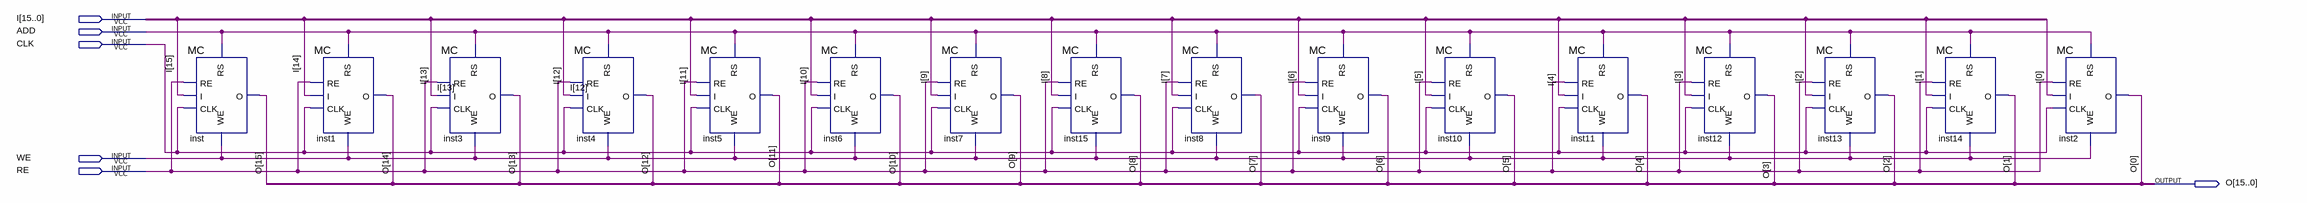
[diagram p0: schematic sheet]
// Quartus schematic DMEM1x16.bdf as structural Verilog: 16 symbols, 6 pins
module DMEM1x16 (
  input  [15:0] I,
  input  ADD,
  input  CLK,
  input  WE,
  input  RE,
  output [15:0] O
);

  MC inst (.RS(ADD), .RE(RE), .CLK(CLK), .I(I[15]), .WE(WE), .O(O[15]));
  MC inst1 (.RS(ADD), .RE(RE), .CLK(CLK), .I(I[14]), .WE(WE), .O(O[14]));
  MC inst3 (.RS(ADD), .RE(RE), .CLK(CLK), .I(I[13]), .WE(WE), .O(O[13]));
  MC inst4 (.RS(ADD), .RE(RE), .CLK(CLK), .I(I[12]), .WE(WE), .O(O[12]));
  MC inst5 (.RS(ADD), .RE(RE), .CLK(CLK), .I(I[11]), .WE(WE), .O(O[11]));
  MC inst6 (.RS(ADD), .RE(RE), .CLK(CLK), .I(I[10]), .WE(WE), .O(O[10]));
  MC inst7 (.RS(ADD), .RE(RE), .CLK(CLK), .I(I[9]), .WE(WE), .O(O[9]));
  MC inst15 (.RS(ADD), .RE(RE), .CLK(CLK), .I(I[8]), .WE(WE), .O(O[8]));
  MC inst8 (.RS(ADD), .RE(RE), .CLK(CLK), .I(I[7]), .WE(WE), .O(O[7]));
  MC inst9 (.RS(ADD), .RE(RE), .CLK(CLK), .I(I[6]), .WE(WE), .O(O[6]));
  MC inst10 (.RS(ADD), .RE(RE), .CLK(CLK), .I(I[5]), .WE(WE), .O(O[5]));
  MC inst11 (.RS(ADD), .RE(RE), .CLK(CLK), .I(I[4]), .WE(WE), .O(O[4]));
  MC inst12 (.RS(ADD), .RE(RE), .CLK(CLK), .I(I[3]), .WE(WE), .O(O[3]));
  MC inst13 (.RS(ADD), .RE(RE), .CLK(CLK), .I(I[2]), .WE(WE), .O(O[2]));
  MC inst14 (.RS(ADD), .RE(RE), .CLK(CLK), .I(I[1]), .WE(WE), .O(O[1]));
  MC inst2 (.RS(ADD), .RE(RE), .CLK(CLK), .I(I[0]), .WE(WE), .O(O[0]));
endmodule
